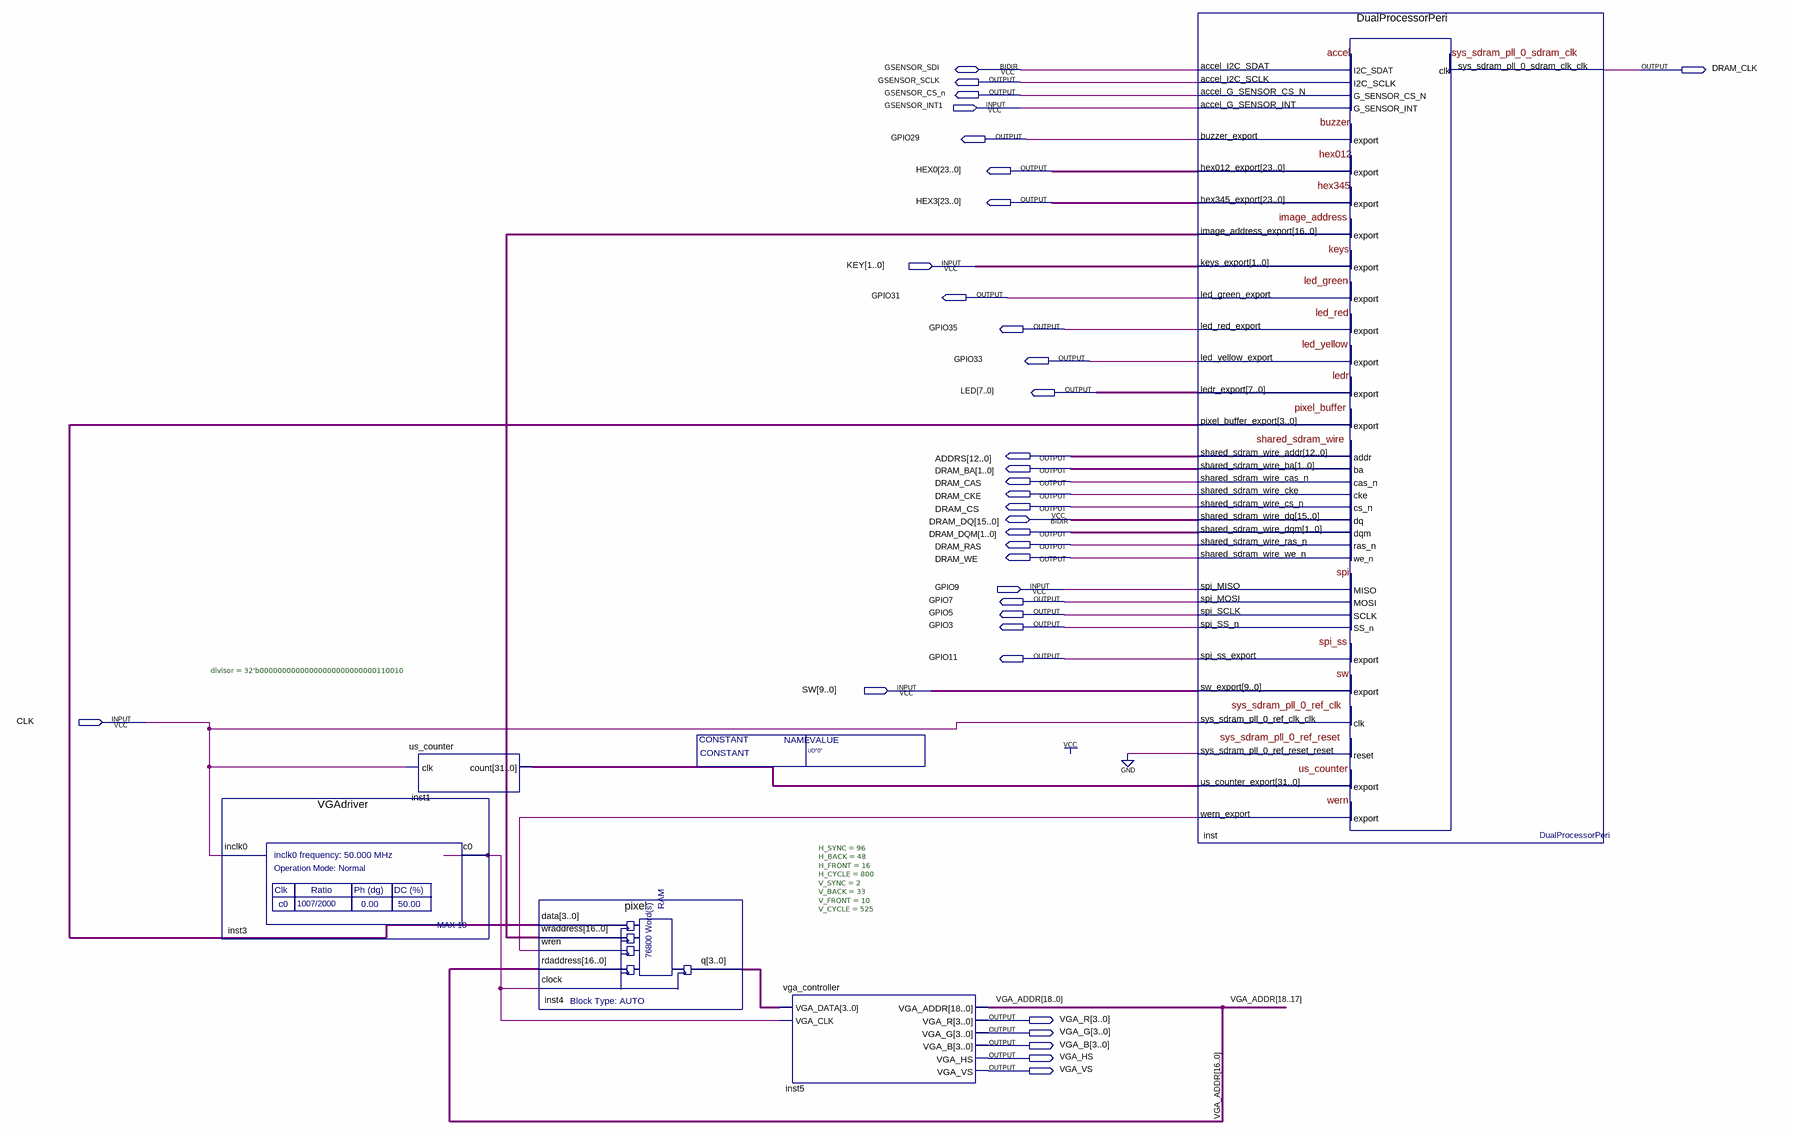
[diagram p0: schematic sheet]
// Quartus schematic ECE3073_Milestone3.bdf as structural Verilog: 5 symbols, 34 pins
module ECE3073_Milestone3 #(parameter CONSTANT = "UD\"0\"") (
  input  GSENSOR_INT1,
  input  [1:0] KEY,
  input  GPIO9,
  input  [9:0] SW,
  input  CLK,
  inout  GSENSOR_SDI,
  inout  [15:0] DRAM_DQ,
  output DRAM_CLK,
  output GSENSOR_SCLK,
  output GSENSOR_CS_n,
  output GPIO29,
  output [23:0] HEX0,
  output [23:0] HEX3,
  output GPIO31,
  output GPIO35,
  output GPIO33,
  output [7:0] LED,
  output [12:0] ADDRS,
  output [1:0] DRAM_BA,
  output DRAM_CAS,
  output DRAM_CKE,
  output DRAM_CS,
  output [1:0] DRAM_DQM,
  output DRAM_RAS,
  output DRAM_WE,
  output GPIO7,
  output GPIO5,
  output GPIO3,
  output GPIO11,
  output [3:0] VGA_R,
  output [3:0] VGA_G,
  output [3:0] VGA_B,
  output VGA_HS,
  output VGA_VS
);

  wire inst3_c0, inst_wern_export;
  wire [3:0] inst4_q, inst_pixel_buffer_export;
  wire [16:0] inst_image_address_export;
  wire [18:0] VGA_ADDR;
  wire [31:0] inst1_count;

  VGAdriver inst3 (.inclk0(CLK), .c0(inst3_c0));
  us_counter #(.divisor(32'b00000000000000000000000000110010)) inst1 (.clk(CLK), .count(inst1_count));
  pixel inst4 (
    .data(inst_pixel_buffer_export), .wraddress(inst_image_address_export), .wren(inst_wern_export),
    .rdaddress(VGA_ADDR[16:0]), .clock(inst3_c0), .q(inst4_q));
  vga_controller #(.H_SYNC(96), .H_BACK(48), .H_FRONT(16), .H_CYCLE(800), .V_SYNC(2), .V_BACK(33), .V_FRONT(10), .V_CYCLE(525)) inst5 (
    .VGA_DATA(inst4_q), .VGA_CLK(inst3_c0), .VGA_ADDR(VGA_ADDR), .VGA_R(VGA_R), .VGA_G(VGA_G), .VGA_B(VGA_B),
    .VGA_HS(VGA_HS), .VGA_VS(VGA_VS));
  DualProcessorPeri inst (
    .accel_G_SENSOR_INT(GSENSOR_INT1), .keys_export(KEY), .spi_MISO(GPIO9), .sw_export(SW),
    .sys_sdram_pll_0_ref_clk_clk(CLK), .sys_sdram_pll_0_ref_reset_reset(1'b0),
    .us_counter_export(inst1_count), .accel_I2C_SCLK(GSENSOR_SCLK), .accel_G_SENSOR_CS_N(GSENSOR_CS_n),
    .buzzer_export(GPIO29), .hex012_export(HEX0), .hex345_export(HEX3),
    .image_address_export(inst_image_address_export), .led_green_export(GPIO31), .led_red_export(GPIO35),
    .led_yellow_export(GPIO33), .ledr_export(LED), .pixel_buffer_export(inst_pixel_buffer_export),
    .shared_sdram_wire_addr(ADDRS), .shared_sdram_wire_ba(DRAM_BA), .shared_sdram_wire_cas_n(DRAM_CAS),
    .shared_sdram_wire_cke(DRAM_CKE), .shared_sdram_wire_cs_n(DRAM_CS), .shared_sdram_wire_dqm(DRAM_DQM),
    .shared_sdram_wire_ras_n(DRAM_RAS), .shared_sdram_wire_we_n(DRAM_WE), .spi_MOSI(GPIO7), .spi_SCLK(GPIO5),
    .spi_SS_n(GPIO3), .spi_ss_export(GPIO11), .sys_sdram_pll_0_sdram_clk_clk(DRAM_CLK),
    .wern_export(inst_wern_export), .accel_I2C_SDAT(GSENSOR_SDI), .shared_sdram_wire_dq(DRAM_DQ));
endmodule
